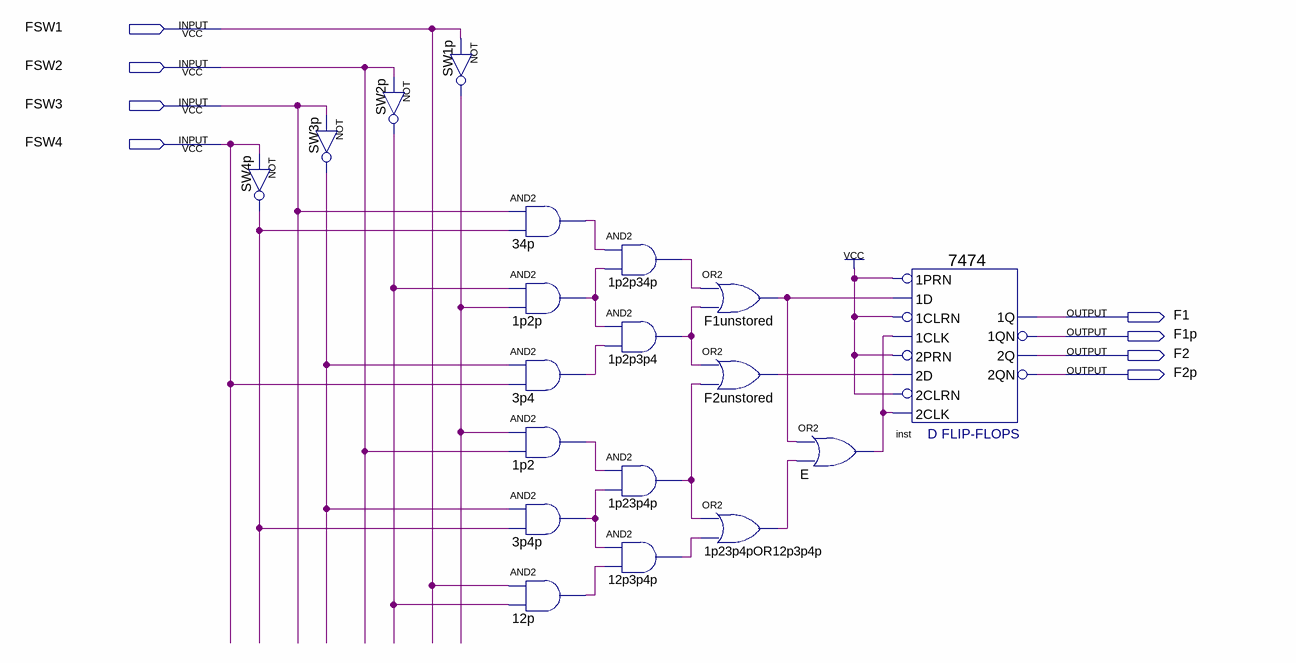
[diagram p0: schematic sheet]
// Quartus schematic Flags.bdf as structural Verilog: 19 symbols, 8 pins
module Flags (
  input  FSW1,
  input  FSW2,
  input  FSW3,
  input  FSW4,
  output F1,
  output F1p,
  output F2,
  output F2p
);

  wire E_out, F1unstored_out, F2unstored_out, n1p2_out, n1p2p3p4_out, n1p2p34p_out, n1p2p_out, n1p23p4p_out,
       n1p23p4pOR12p3p4p_out, n3p4_out, n3p4p_out, n12p3p4p_out, n12p_out, n34p_out, SW1p_out, SW2p_out,
       SW3p_out, SW4p_out;

  not SW4p (SW4p_out, FSW4);
  not SW3p (SW3p_out, FSW3);
  not SW2p (SW2p_out, FSW2);
  not SW1p (SW1p_out, FSW1);
  and u_34p (n34p_out, FSW3, SW4p_out);
  and u_1p2p (n1p2p_out, SW2p_out, SW1p_out);
  and u_3p4 (n3p4_out, SW3p_out, FSW4);
  and u_1p2 (n1p2_out, SW1p_out, FSW2);
  and u_3p4p (n3p4p_out, SW3p_out, SW4p_out);
  and u_12p (n12p_out, FSW1, SW2p_out);
  and u_1p2p34p (n1p2p34p_out, n34p_out, n1p2p_out);
  and u_1p2p3p4 (n1p2p3p4_out, n1p2p_out, n3p4_out);
  and u_1p23p4p (n1p23p4p_out, n1p2_out, n3p4p_out);
  and u_12p3p4p (n12p3p4p_out, n3p4p_out, n12p_out);
  or F1unstored (F1unstored_out, n1p2p34p_out, n1p2p3p4_out);
  or F2unstored (F2unstored_out, n1p2p3p4_out, n1p23p4p_out);
  or u_1p23p4pOR12p3p4p (n1p23p4pOR12p3p4p_out, n1p23p4p_out, n12p3p4p_out);
  or E (E_out, F1unstored_out, n1p23p4pOR12p3p4p_out);
  \7474  inst (
    .\2D (F2unstored_out), .\2PRN (1'b1), .\1CLK (E_out), .\1D (F1unstored_out), .\1PRN (1'b1),
    .\2CLK (E_out), .\2CLRN (1'b1), .\1CLRN (1'b1), .\1QN (F1p), .\2Q (F2), .\2QN (F2p), .\1Q (F1));
endmodule
